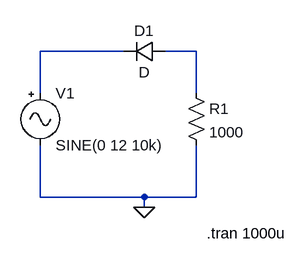
[diagram p0: schematic halfWaveRectifier.asc]
halfWaveRectifier.asc, the LTspice schematic file:
Version 4
SHEET 1 880 680
WIRE 112 64 -16 64
WIRE 224 64 176 64
WIRE -16 128 -16 64
WIRE 224 128 224 64
WIRE -16 288 -16 208
WIRE 144 288 -16 288
WIRE 224 288 224 208
WIRE 224 288 144 288
WIRE 144 304 144 288
FLAG 144 304 0
SYMBOL res 208 112 R0
SYMATTR InstName R1
SYMATTR Value 1000
SYMBOL Misc\\signal -16 112 R0
WINDOW 123 0 0 Left 0
WINDOW 39 0 0 Left 0
SYMATTR InstName V1
SYMATTR Value SINE(0 12 10k)
SYMBOL diode 176 48 R90
WINDOW 0 0 32 VBottom 2
WINDOW 3 32 32 VTop 2
SYMATTR InstName D1
TEXT 240 344 Left 2 !.tran 1000u

The netlist it stands for:
* halfWaveRectifier.asc
R1 N002 0 1000
V1 N001 0 SINE(0 12 10k)
D1 N002 N001 D
.model D D
.lib standard.dio
.tran 1000u
.backanno
.end